# EAGLE design BDL Eagle (EAGLE 8.1.0)
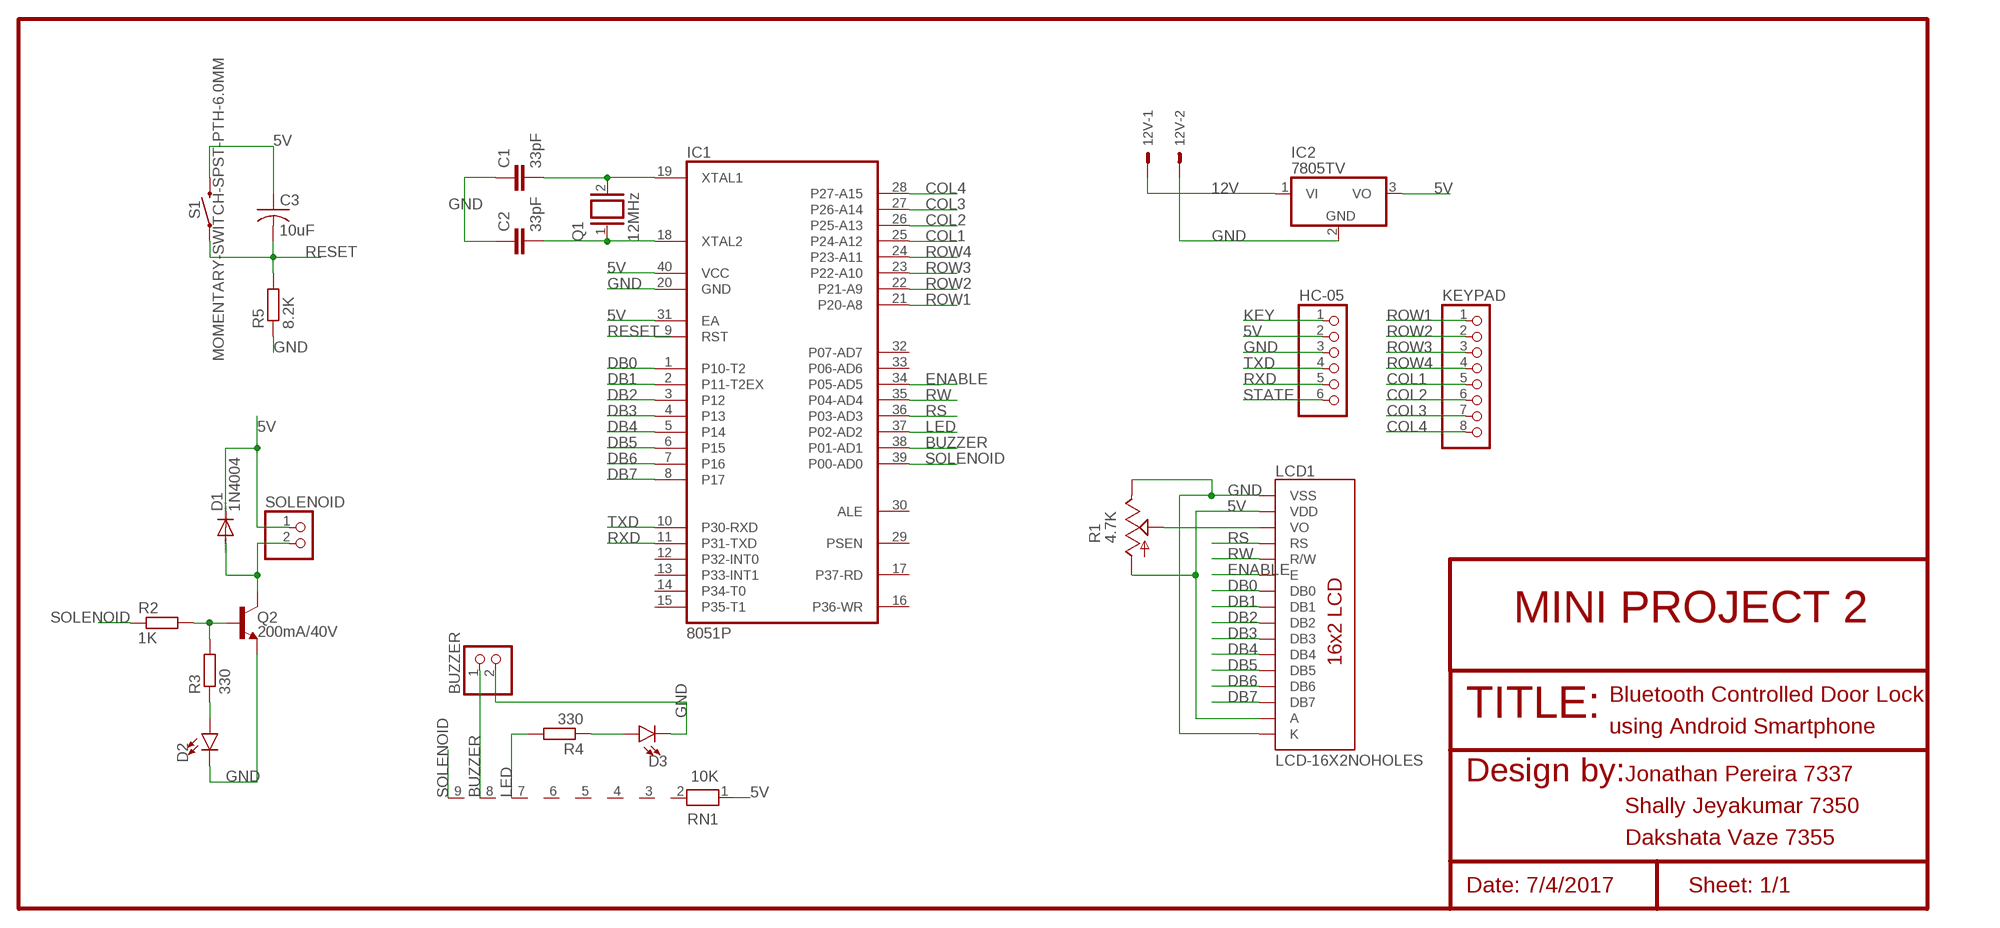
[diagram p0: schematic, sheet 1]

## Parts
12V  KK-156-2  [KK-156-2]
BUZZER  PINHD-1X2  [1X02]
C1  33pF  C2.5/2  [C2.5-2]
C2  33pF  C2.5/2  [C2.5-2]
C3  10uF  C-US025-050X050  [C025-050X050]
D1  1N4004  [DO41-10]
D2  LED5MM  [LED_5MM]
D3  LED5MM  [LED_5MM]
HC-05  PINHD-1X6  [1X06]
IC1  8051P  [DIL40]
IC2  7805TV  [TO220V]
KEYPAD  PINHD-1X8  [1X08]
LCD1  LCD-16X2NOHOLES  [LCD-16X2_NOHOLESNOSILK]
Q1  12MHz  XTAL/S  [QS]
Q2  200mA/40V  TRANS_NPN-2N3904-EZ  [TO-92-EZ]
R1  4.7K  TRIM_US-CA6V  [CA6V]
R2  1K  R-EU_0204/7  [0204/7]
R3  330  R-EU_0204/7  [0204/7]
R4  330  R-EU_0204/7  [0204/7]
R5  8.2K  R-EU_0204/7  [0204/7]
RN1  10K  RN08  [RN-9]
S1  MOMENTARY-SWITCH-SPST-PTH-6.0MM  [TACTILE_SWITCH_PTH_6.0MM]
SOLENOID  PINHD-1X2  [1X02]

## Nets
5V: C3.1 D1.C HC-05.2 IC1.31(EA) IC1.40(VCC) IC2.3(VO) LCD1.2(VDD) LCD1.15(A) R1.A RN1.1 S1.3 SOLENOID.1
12V: 12V.1 IC2.1(VI)
BUZZER: BUZZER.1 IC1.38(P01-AD1) RN1.8
COL1: IC1.25(P24-A12) KEYPAD.5
COL2: IC1.26(P25-A13) KEYPAD.6
COL3: IC1.27(P26-A14) KEYPAD.7
COL4: IC1.28(P27-A15) KEYPAD.8
DB0: IC1.1(P10-T2) LCD1.7(DB0)
DB1: IC1.2(P11-T2EX) LCD1.8(DB1)
DB2: IC1.3(P12) LCD1.9(DB2)
DB3: IC1.4(P13) LCD1.10(DB3)
DB4: IC1.5(P14) LCD1.11(DB4)
DB5: IC1.6(P15) LCD1.12(DB5)
DB6: IC1.7(P16) LCD1.13(DB6)
DB7: IC1.8(P17) LCD1.14(DB7)
ENABLE: IC1.34(P05-AD5) LCD1.6(E)
GND: 12V.2 BUZZER.2 C1.1 C2.1 D2.K(C) D3.K(C) HC-05.3 IC1.20(GND) IC2.2(GND) LCD1.1(VSS) LCD1.16(K) Q2.1(E) R1.E R5.1
KEY: HC-05.1
LED: IC1.37(P02-AD2) R4.2 RN1.7
N$1: C1.2 IC1.19(XTAL1) Q1.2
N$2: C2.2 IC1.18(XTAL2) Q1.1
N$3: D2.A R3.1
N$4: Q2.2(B) R2.2 R3.2
N$6: D3.A R4.1
N$7: D1.A Q2.3(C) SOLENOID.2
RESET: C3.2 R5.2 S1.1
ROW1: IC1.21(P20-A8) KEYPAD.1
ROW2: IC1.22(P21-A9) KEYPAD.2
ROW3: IC1.23(P22-A10) KEYPAD.3
ROW4: IC1.24(P23-A11) KEYPAD.4
RS: IC1.36(P03-AD3) LCD1.4(RS)
RW: IC1.35(P04-AD4) LCD1.5(R/W)
RXD: HC-05.5 IC1.11(P31-TXD)
SOLENOID: IC1.39(P00-AD0) R2.1 RN1.9
STATE: HC-05.6
TXD: HC-05.4 IC1.10(P30-RXD)
VO: LCD1.3(VO) R1.S
Unconnected: IC1.9(RST) IC1.12(P32-INT0) IC1.13(P33-INT1) IC1.14(P34-T0) IC1.15(P35-T1) IC1.16(P36-WR) IC1.17(P37-RD) IC1.29(PSEN) IC1.30(ALE) IC1.32(P07-AD7) IC1.33(P06-AD6) RN1.2 RN1.3 RN1.4 RN1.5 RN1.6

## Notes on the sheet
- MINI PROJECT 2
- Bluetooth Controlled Door Lock
- TITLE:
- using Android Smartphone
- Design by: | Jonathan Pereira 7337
- Shally Jeyakumar 7350
- Dakshata Vaze 7355
- Date: 7/4/2017 | Sheet: 1/1

## Library data of the parts
12V = con-molex:KK-156-2: KK 156 HEADER Source: http://www.molex.com/pdm_docs/sd/026604100_sd.pdf; OC_FARNELL: unknown; OC_NEWARK: unknown
BUZZER SOLENOID = pinhead:PINHD-1X2: PIN HEADER
C1 C2 = capacitor-wima:C: CAPACITOR naming: grid - package width
C3 = rcl:C-US: CAPACITOR, American symbol
D1 = diode:1N4004: DIODE general purpose rectifier, 1 A
D2 D3 = SparkFun-LED:LED: LED (Generic) Standard schematic elements and footprints for 5mm, 3mm, 1206, and 0603 sized LEDs. Generic LEDs with no color specified.
HC-05 = pinhead:PINHD-1X6: PIN HEADER
IC1 = micro-intel:8051: (CHMOS) SINGLE-CHIP 8-BIT MICROCONTROLLER 80C31BH / 80C51 BH / 87C51 MCS 51 Source: http://apps.intel.com .. 27041907.pdf; OC_FARNELL: unknown; OC_NEWARK: unknown
IC2 = linear:78*: Positive VOLTAGE REGULATOR Source: http://cache.national.com/ds/LM/LM78L05.pdf http://www.fairchildsemi.com/ds/LM/LM7805.pdf
KEYPAD = pinhead:PINHD-1X8: PIN HEADER
LCD1 = SparkFun-Displays:LCD-16X2: Standard text-only 16x2 parallel input LCD Basic 16 character by 2 line display. Typically utilizes the extremely common HD44780 parallel interface chipset SparkFun Products: Basic 16x2 Green <https://www.sparkfun.com/products/255> Basic 8x2 Green <https://www.sparkfun.com/products/11122>; SF_ID: LCD-00255
Q1 = special:XTAL/S: CRYSTAL
Q2 = SparkFun-DiscreteSemi:TRANS_NPN: NPN transistor Current controlled devices typically used to amplify current or used as a switch. BC547 - COM-08928 <http://www.sparkfun.com/products/8928> (TO-92 45V 100mA) (1.Collector 2.Base 3.Emitter) 2N3904 - COM-00521 <http://www.sparkfun.com/products/521> (TO-92 40V 200mA) (1.Emitter 2.Base 3.Collector) P2N2222A - COM-12852 <http://www.sparkfun.com/products/12852> (TO-92 40V 600mA) (1.Collector 2.Base 3.Emitter); PROD_ID: TRANS-08447
R1 = pot:TRIM_US-: POTENTIOMETER
R2 = rcl:R-EU_: RESISTOR, European symbol
R3-R5 = resistor:R-EU_: RESISTOR, European symbol
RN1 = resistor-net:RN08: RESISTOR NETWORK; OC_FARNELL: unknown; OC_NEWARK: unknown
S1 = SparkFun-Switches:MOMENTARY-SWITCH-SPST: Momentary Switch (Pushbutton) - SPST Normally-open (NO) SPST momentary switches (buttons, pushbuttons). Variants PTH-12MM - 12mm square, through-hole Momentary Pushbutton Switch - 12mm Square <https://www.sparkfun.com/products/9190> (COM-09190) PTH-6.0MM, PTH-6.0MM-KIT - 6.0mm square, through-hole Mini Pushbutton Switch <https://www.sparkfun.com/products/97> (COM-00097) KIT package intended for soldering kit's - only one side of pads' copper is exposed. PTH-RIGHT-ANGLE-KIT - Right-angle, through-hole Right Angle Tactile Button <https://www.sparkfun.com/products/10791> - Used on SparkFun BigTime Watch Kit <https://www.sparkfun.com/products/11734> SMD-12MM - 12mm square, surface-mount Tactile Button - SMD (12mm) <https://www.sparkfun.com/products/12993> (COM-12993) Used on SparkFun PicoBoard <https://www.sparkfun.com/products/11888> SMD-4.5MM - 4.5mm Square Trackball Switch Used on SparkFun Blackberry Trackballer Breakout <https://www.sparkfun.com/products/13169> SMD-4.6MMX2.8MM - 4.60mm x 2.80mm, surface mount Used on SparkFun SAMD21 Mini Breakout <https://www.sparkfun.com/products/13664> SMD-5.2MM, SMD-5.2-REDUNDANT - 5.2mm square, surface-mount Mini Pushbutton Switch - SMD <https://www.sparkfun.com/products/8720> (COM-08720) Used on Arduino Pro Mini <https://www.sparkfun.com/products/11114> REDUNDANT package connects both switch circuits together SMD-6.0X3.5MM - 6.0 x 3.5mm, surface mount Momentary Reset Switch SMD <https://www.sparkfun.com/products/8229> (COM-08229) SMD-6.2MM-TALL - 6.2mm square, surface mount Tactile Button - SMD (6mm) <https://www.sparkfun.com/products/12992> Used on SparkFun Digital Sandbox <https://www.sparkfun.com/products/12651> SMD-RIGHT-ANGLE - Right-angle, surface mount Used on SparkFun Block for Intel® Edison - Arduino <https://www.sparkfun.com/products/13036>; PROD_ID: SWCH-08441; SF_SKU: COM-00097

## Board
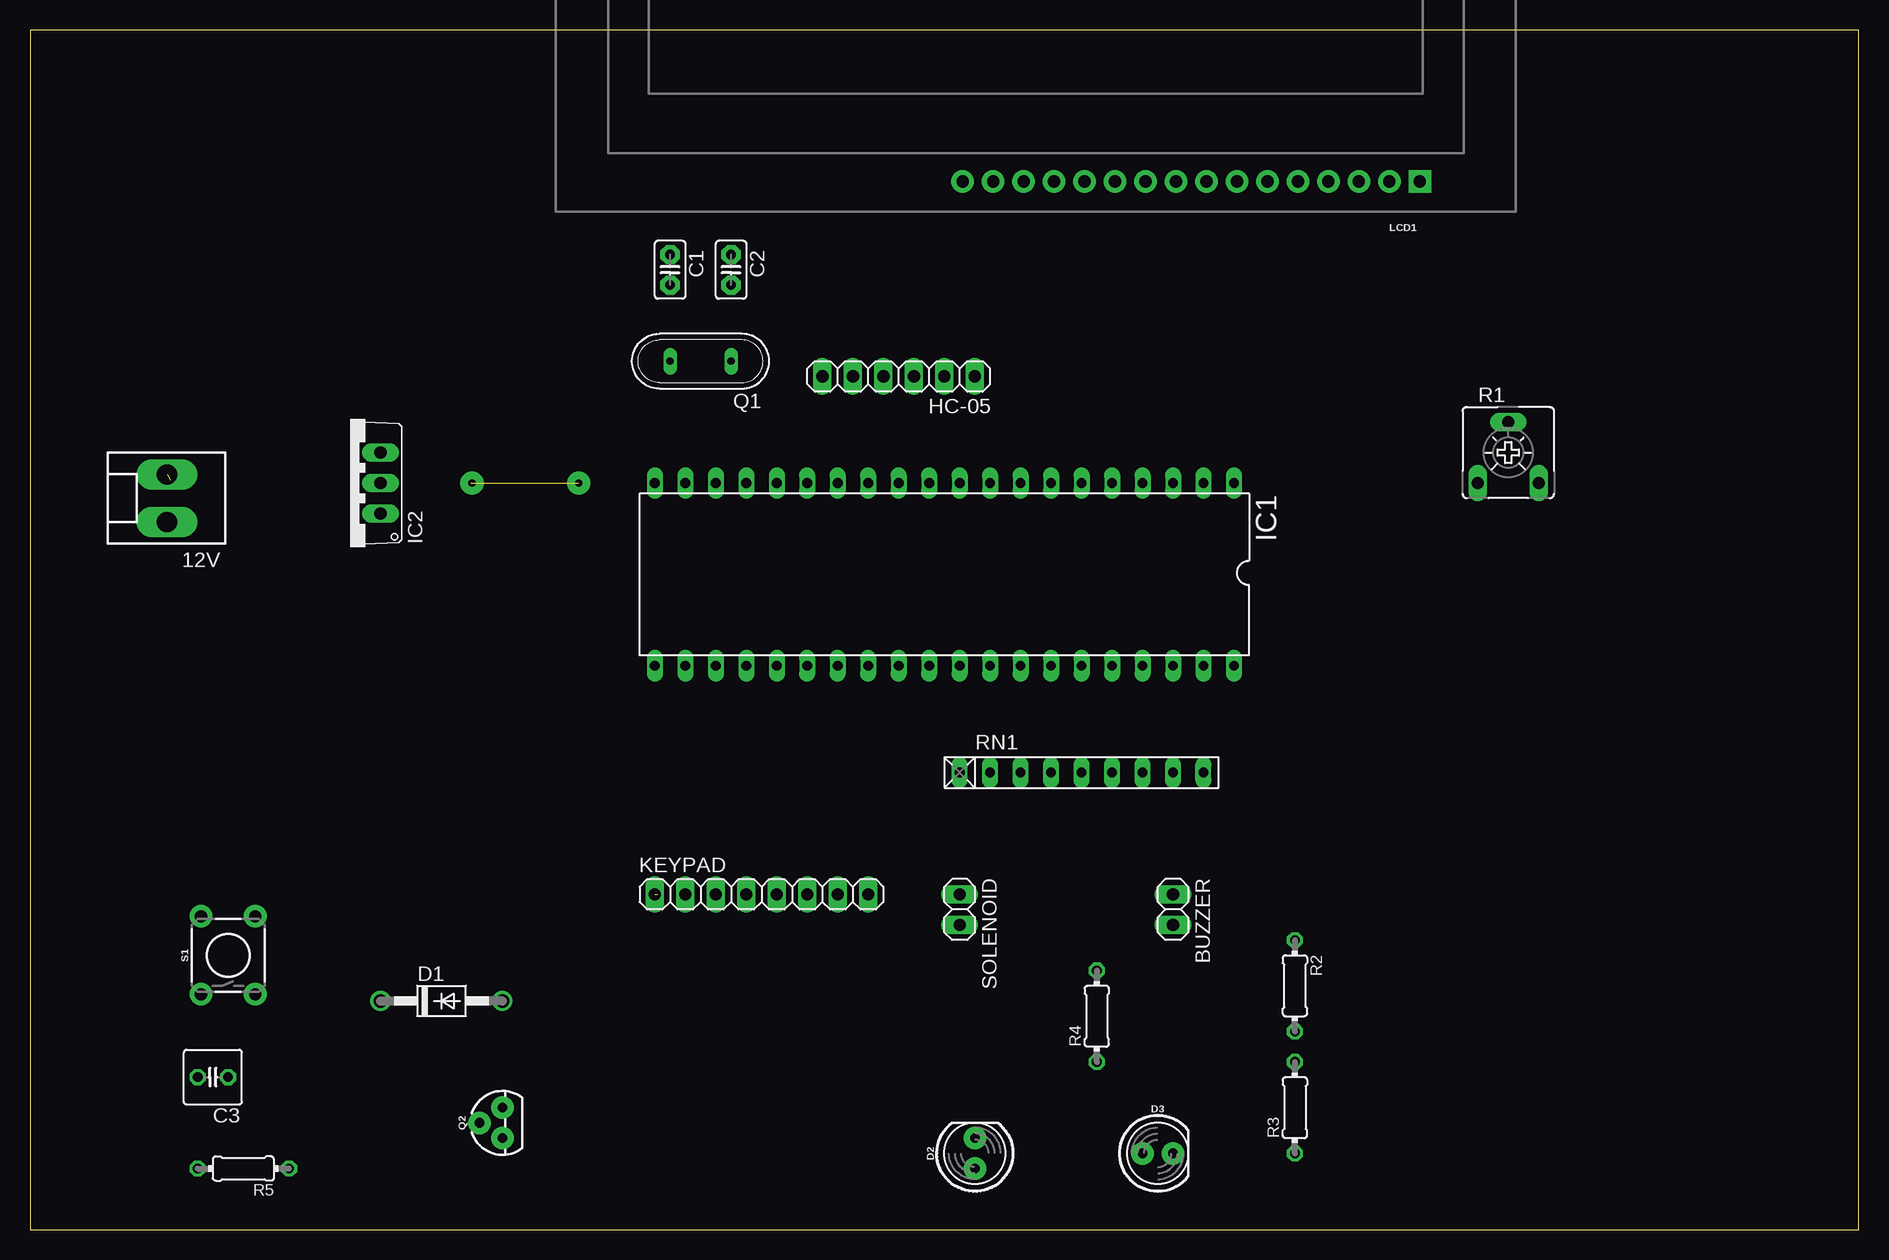
[diagram p1: board, top side]
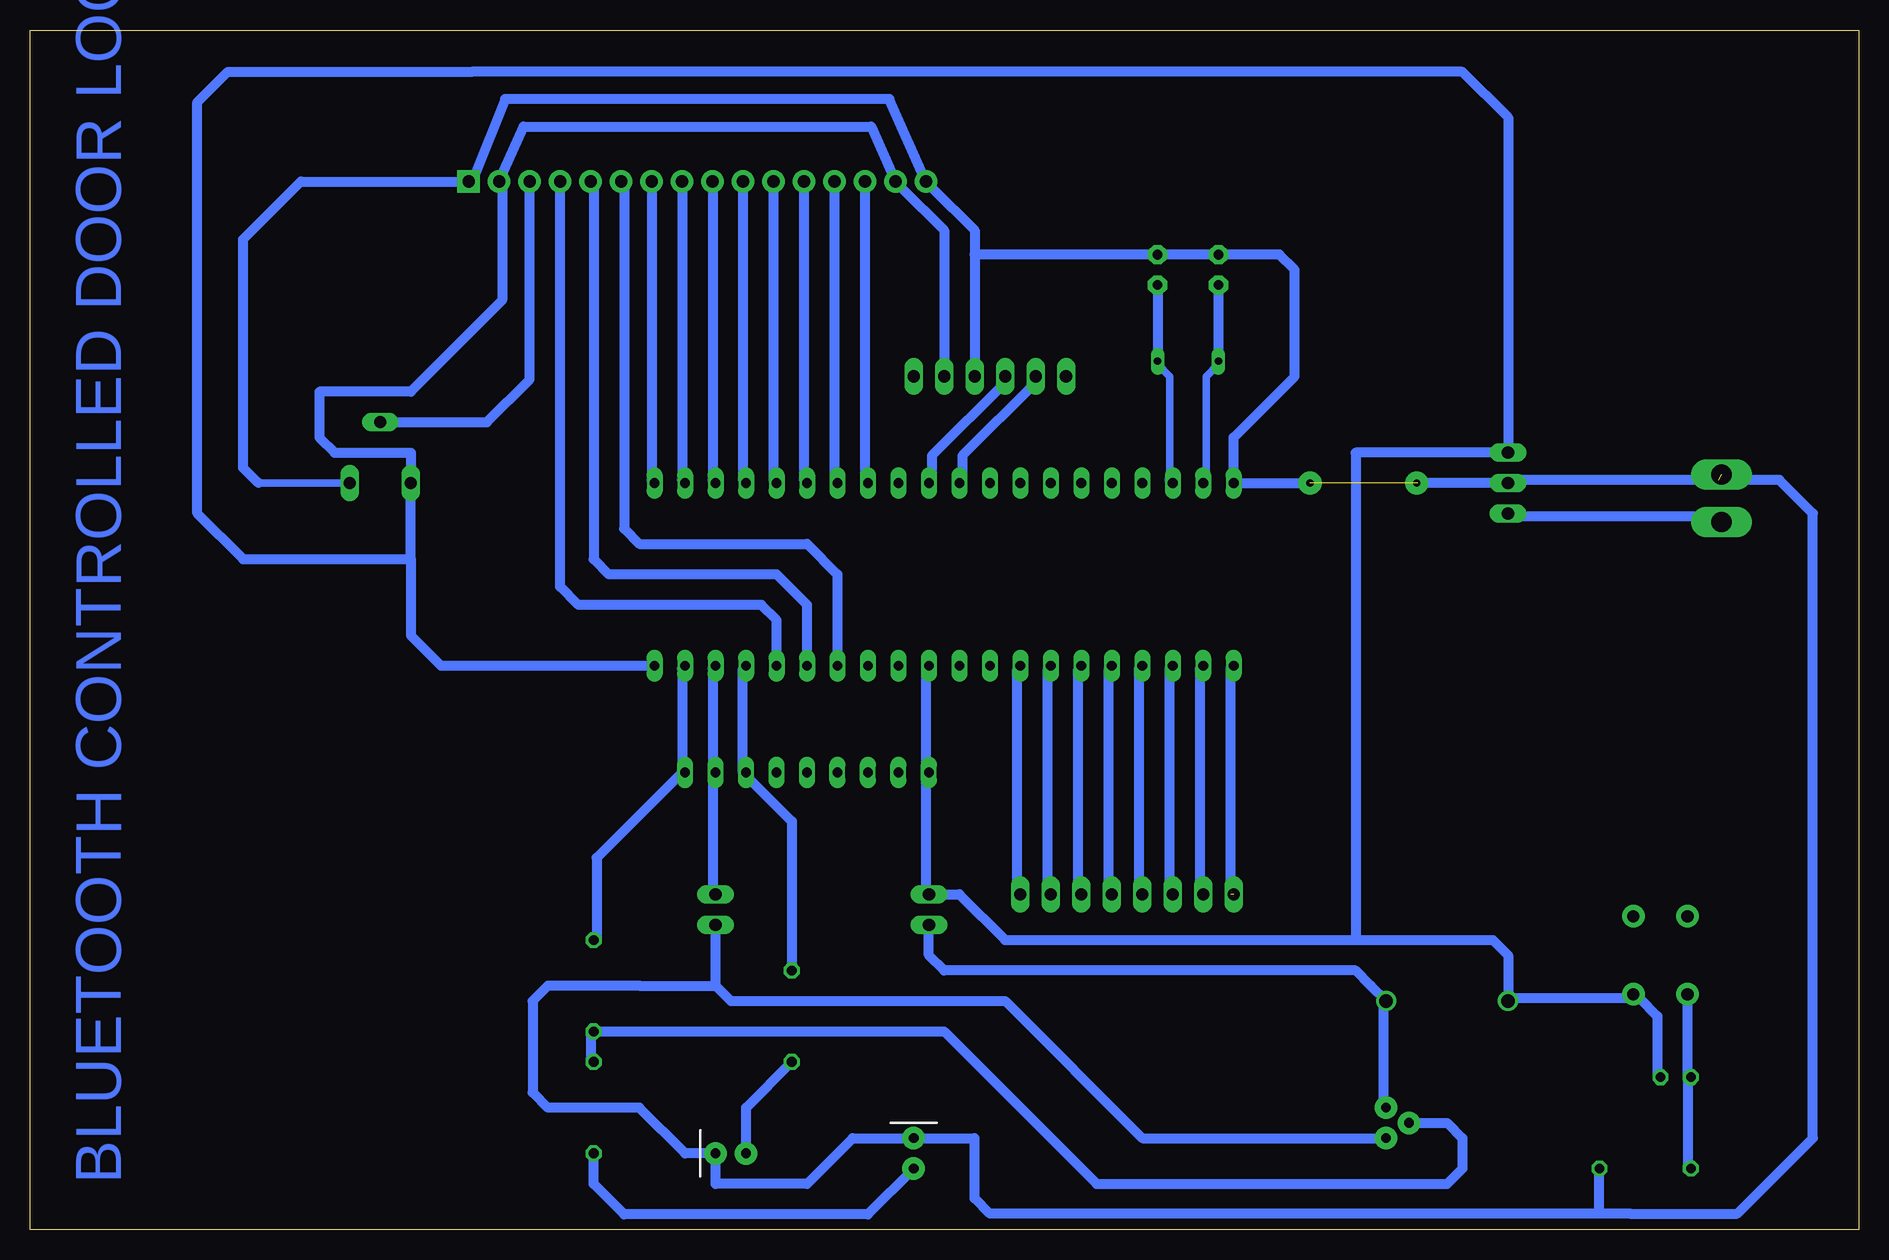
[diagram p2: board, bottom side, seen from below]

Size 152.38 x 100 mm. Coordinates in mm from the lower left corner, seen from the top.
Outline: 0,0 152.38,0 152.38,100 0,100 0,0
Copper layers (1*16): Top 0.035mm / dielectric 1.5mm / Bottom 0.035mm
Design rules "default *": minimum track width 20mil, minimum drill 24mil, track to track 20mil, track to pad 20mil, pad to pad 20mil, via to via 20mil, smd to smd 20mil, copper to edge 40mil, drill to drill 8mil, minimum pad ring 10mil, minimum via ring 8mil, stop-mask expansion 4mil, vias tented up to drill 0mil, thermal gap 10mil

### Footprints (pad centres in the part's own frame; a part is rotated, then mirrored left to right if it is on the bottom)
KK-156-2 = drill 1.7 pad 2.184 long: 1 -1.98,0; 2 1.98,0
1X02 = drill 1.016 long: 1 -1.27,0; 2 1.27,0
C2.5-2 = drill 0.813 pad 1.6 octagon: 1 -1.27,0; 2 1.27,0
C025-050X050 = drill 0.813 octagon: 1 -1.27,0; 2 1.27,0
DO41-10 = drill 1.118: A 5.08,0; C -5.08,0
LED_5MM = drill 0.813 pad 1.88: A -1.27,0; K 1.27,0
1X06 = drill 1.016 long: 1 -6.35,0; 2 -3.81,0; 3 -1.27,0; 4 1.27,0; 5 3.81,0; 6 6.35,0
DIL40 = drill 0.813 long: 1 -24.13,-7.62; 2 -21.59,-7.62; 3 -19.05,-7.62; 4 -16.51,-7.62; 5 -13.97,-7.62; 6 -11.43,-7.62; 7 -8.89,-7.62; 8 -6.35,-7.62; 9 -3.81,-7.62; 10 -1.27,-7.62; 11 1.27,-7.62; 12 3.81,-7.62; 13 6.35,-7.62; 14 8.89,-7.62; 15 11.43,-7.62; 16 13.97,-7.62; 17 16.51,-7.62; 18 19.05,-7.62; 19 21.59,-7.62; 20 24.13,-7.62; 21 24.13,7.62; 22 21.59,7.62; 23 19.05,7.62; 24 16.51,7.62; 25 13.97,7.62; 26 11.43,7.62; 27 8.89,7.62; 28 6.35,7.62; 29 3.81,7.62; 30 1.27,7.62; 31 -1.27,7.62; 32 -3.81,7.62; 33 -6.35,7.62; 34 -8.89,7.62; 35 -11.43,7.62; 36 -13.97,7.62; 37 -16.51,7.62; 38 -19.05,7.62; 39 -21.59,7.62; 40 -24.13,7.62
TO220V = drill 1.016 long: 1 -2.54,-2.54; 2 0,-2.54; 3 2.54,-2.54
1X08 = drill 1.016 long: 1 -8.89,0; 2 -6.35,0; 3 -3.81,0; 4 -1.27,0; 5 1.27,0; 6 3.81,0; 7 6.35,0; 8 8.89,0
LCD-16X2_NOHOLESNOSILK = drill 1.016 pad 1.88 square: 1 -32,15.5 | drill 1.016 pad 1.88: 2 -29.46,15.5; 3 -26.92,15.5; 4 -24.38,15.5; 5 -21.84,15.5; 6 -19.3,15.5; 7 -16.76,15.5; 8 -14.22,15.5; 9 -11.68,15.5; 10 -9.14,15.5; 11 -6.6,15.5; 12 -4.06,15.5; 13 -1.52,15.5; 14 1.02,15.5; 15 3.56,15.5; 16 6.1,15.5
QS = drill 0.61 long: 1 -2.54,0; 2 2.54,0
TO-92-EZ = drill 0.813 pad 1.88: 1 -1.27,0; 2 0,1.905; 3 1.27,0
CA6V = drill 1.016 long: A -2.54,-2.54; E 2.54,-2.54; S 0,2.54
0204/7 = drill 0.813 octagon: 1 -3.81,0; 2 3.81,0
RN-9 = drill 0.813 long: 1 -10.16,0; 2 -7.62,0; 3 -5.08,0; 4 -2.54,0; 5 0,0; 6 2.54,0; 7 5.08,0; 8 7.62,0; 9 10.16,0
TACTILE_SWITCH_PTH_6.0MM = drill 1.016 pad 1.88: 1 -3.251,2.261; 2 3.251,2.261; 3 -3.251,-2.261; 4 3.251,-2.261

### Placement (x,y rotation side)
12V  11.43,60.96 90 top
BUZZER  95.25,26.67 270 top
C1  53.34,80.01 270 top
C2  58.42,80.01 270 top
C3  15.24,12.7 180 top
D1  34.29,19.05 0 top
D2  78.74,6.35 90 top
D3  93.98,6.35 0 top
HC-05  72.39,71.12 180 top
IC1  76.2,54.61 180 top
IC2  26.67,62.23 90 top
KEYPAD  60.96,27.94 0 top
LCD1  83.82,102.87 180 top
Q1  55.88,72.39 180 top
Q2  39.37,8.89 90 top
R1  123.19,64.77 0 top
R2  105.41,20.32 270 top
R3  105.41,10.16 90 top
R4  88.9,17.78 90 top
R5  17.78,5.08 180 top
RN1  87.63,38.1 0 top
S1  16.51,22.86 90 top
SOLENOID  77.47,26.67 270 top

### Tracks (layer width: path | path; a pad name or v marks a point on that pad's centre or on a via)
5V
  Bottom 0.508: 79.76,86.87 LCD1.15 | 100.58,47.24 IC1.40 | 113.28,86.87 LCD1.2 | R1.A 120.9,61.98 | 77.72,46.74 IC1.31 | 77.72,27.94 SOLENOID.1 | 77.72,38.1 RN1.1 | 16.76,12.7 C3.1 | 18.29,19.3 S1.3 18.8,19.3 | D1.C 28.96,19.3 | 115.57,96.52 116.08,96.52
  Bottom 0.61: LCD1.2 113.03,87.12
  Bottom 0.813: HC-05.2 76.2,83.31 79.76,86.87 | LCD1.15 82.3,91.95 111.25,91.95 LCD1.2 | 77.72,46.74 77.72,38.1 77.72,27.94 | 16.76,12.7 16.76,17.78 18.29,19.3 | 28.96,19.3 18.8,19.3 | 120.65,55.88 134.62,55.88 138.43,59.69 138.43,93.98 135.89,96.52 115.57,96.52 33.02,96.52 29.21,92.71 IC2.3 41.91,64.77 41.91,24.13 | IC1.40 118.11,46.99 120.65,49.53 120.65,55.88 | 120.65,55.88 R1.A 120.65,64.77 127,64.77 128.27,66.04 128.27,69.85 120.65,69.85 113.03,77.47 113.03,87.12 | SOLENOID.1 74.93,27.94 71.12,24.13 41.91,24.13 | 41.91,24.13 30.48,24.13 29.21,22.86 D1.C
12V
  Bottom 0.508: 28.96,59.44 IC2.1 | 11.68,59.44 12V.1
  Bottom 0.813: 11.68,59.44 28.96,59.44
BUZZER
  Bottom 0.508: 95.5,46.74 IC1.38 | 95.5,27.94 BUZZER.1 | 95.5,38.1 RN1.8
  Bottom 0.813: 95.5,46.74 95.5,38.1 95.5,27.94
COL1
  Bottom 0.508: 62.48,46.74 IC1.25 | 62.48,27.94 KEYPAD.5
  Bottom 0.813: 62.48,27.94 62.48,46.74
COL2
  Bottom 0.508: 65.02,46.74 IC1.26 | 65.02,27.94 KEYPAD.6
  Bottom 0.813: 65.02,27.94 65.02,46.74
COL3
  Bottom 0.508: 67.56,46.74 IC1.27 | 67.56,27.94 KEYPAD.7
  Bottom 0.813: 67.56,27.94 67.56,46.74
COL4
  Bottom 0.508: 70.1,46.74 IC1.28 | 70.1,27.94 KEYPAD.8
  Bottom 0.813: 70.1,27.94 70.1,46.74
DB0
  Bottom 0.508: 100.58,62.48 IC1.1 | 100.58,86.87 LCD1.7
  Bottom 0.813: 100.58,86.87 100.58,62.48
DB1
  Bottom 0.508: 98.04,62.48 IC1.2 | 98.04,86.87 LCD1.8
  Bottom 0.813: 98.04,86.87 98.04,62.48
DB2
  Bottom 0.508: 95.5,62.48 IC1.3 | 95.5,86.87 LCD1.9
  Bottom 0.813: 95.5,86.87 95.5,62.48
DB3
  Bottom 0.813: IC1.4 92.96,62.48 92.96,86.87 LCD1.10
DB4
  Bottom 0.813: IC1.5 90.42,62.48 90.42,86.87 LCD1.11
DB5
  Bottom 0.813: IC1.6 87.88,62.48 87.88,86.87 LCD1.12
DB6
  Bottom 0.813: IC1.7 85.34,62.48 85.34,86.87 LCD1.13
DB7
  Bottom 0.813: IC1.8 82.8,62.48 82.8,86.87 LCD1.14
ENABLE
  Bottom 0.508: 85.34,47.75 85.34,47.24 IC1.34 | 102.62,86.87 LCD1.6
  Bottom 0.61: LCD1.6 102.87,87.12
  Bottom 0.813: 102.87,87.12 102.87,58.42 101.6,57.15 87.63,57.15 85.09,54.61 IC1.34
GND  (via drill 0.6 pad 1.93)  (2 unrouted)
  Bottom 0.508: D3.K 95.5,6.6 | 95,25.4 BUZZER.2 | 12.7,62.48 11.68,62.48 | 28.96,62.48 IC2.2 | 125.98,62.48 R1.E | 115.82,86.87 LCD1.1 115.32,87.38 115.32,87.88 | 77.22,86.87 LCD1.16 | 51.82,62.48 IC1.20
  Bottom 0.61: 21.34,5.08 R5.1 | R1.E 133.35,62.23 | 100.33,20.32 101.6,20.32 | 19.05,1.32 | 21.59,1.32
  Bottom 0.813: 28.96,62.48 12.7,62.48 6.6,62.48 3.81,59.69 3.81,7.62 10.11,1.32 19.05,1.32 21.59,1.32 | 73.66,81.28 73.66,83.31 77.22,86.87 | 73.66,81.28 HC-05.3 | 73.66,81.28 C2.1 C1.1 48.26,81.28 46.99,80.01 46.99,71.12 52.07,66.04 IC1.20 v45.72,62.23 | 115.32,87.88 112.78,94.23 80.77,94.23 LCD1.16 | IC2.2 36.72,62.23 | 133.35,62.23 134.62,63.5 134.62,82.55 129.8,87.37 LCD1.1 | 21.59,1.32 R5.1 | 21.59,1.32 72.39,1.32 73.66,2.59 73.66,7.62 D2.K 83.82,7.62 87.63,3.81 95.25,3.81 D3.K 97.79,6.35 101.6,10.16 109.22,10.16 110.49,11.43 110.49,19.05 109.22,20.32 101.6,20.32 95.25,20.32 | 95.25,20.32 BUZZER.2 | 95.25,20.32 93.98,19.05 71.12,19.05 59.69,7.62 Q2.1
LED
  Bottom 0.508: 92.96,46.74 IC1.37 | 92.96,38.1 RN1.7
  Bottom 0.813: R4.2 88.9,34.04 92.96,38.1 92.96,46.74
N$1
  Bottom 0.508: 53.34,72.14 Q1.2
  Bottom 0.61: 54.36,62.48 54.36,71.12 53.34,72.14
  Bottom 0.813: C1.2 Q1.2 | 54.36,62.48 IC1.19
N$2
  Bottom 0.508: 58.42,72.14 Q1.1
  Bottom 0.61: 57.4,62.48 57.4,71.12 58.42,72.14
  Bottom 0.813: C2.2 Q1.1 | 57.4,62.48 IC1.18
N$3
  Bottom 0.508: R3.1 105.16,6.1
  Bottom 0.813: R3.1 105.41,3.81 102.87,1.27 82.55,1.27 D2.A
N$4
  Bottom 0.508: 105.66,16.26 R2.2 105.16,16.26 | 37.59,8.64 Q2.2
  Bottom 0.813: 105.66,16.26 105.66,14.22 R3.2 | Q2.2 34.29,8.89 33.02,7.62 33.02,5.08 34.29,3.81 63.5,3.81 76.2,16.51 R2.2
N$5  (via drill 0.6 pad 1.93)
  other vias: 36.83,62.23
N$6
  Bottom 0.813: R4.1 92.71,10.16 D3.A
N$7
  Bottom 0.508: 40.64,20.32 41.15,20.83 | 39.62,10.16 Q2.3 | 39.62,18.8 D1.A
  Bottom 0.813: D1.A 40.64,20.32 41.91,21.59 76.2,21.59 77.47,22.86 SOLENOID.2 | 39.62,18.8 39.62,10.16
RESET
  Bottom 0.508: 14.22,19.3 S1.1 | 14.22,12.7 C3.2
  Bottom 0.61: 14.22,5.08 R5.2
  Bottom 0.813: 14.22,5.08 14.22,12.7 14.22,19.3
ROW1  (1 unrouted)
  Bottom 0.508: 52.32,46.74 IC1.21
  Bottom 0.813: 52.32,27.94 52.32,46.74
ROW2
  Bottom 0.508: 54.86,46.74 IC1.22 | 54.86,27.94 KEYPAD.2
  Bottom 0.813: 54.86,27.94 54.86,46.74
ROW3
  Bottom 0.508: 57.4,46.74 IC1.23 | 57.4,27.94 KEYPAD.3
  Bottom 0.813: 57.4,27.94 57.4,46.74
ROW4
  Bottom 0.508: 59.94,46.74 IC1.24 | 59.94,27.94 KEYPAD.4
  Bottom 0.813: 59.94,27.94 59.94,46.74
RS
  Bottom 0.508: 90.42,47.75 90.42,47.24 IC1.36
  Bottom 0.61: LCD1.4 107.95,87.12
  Bottom 0.813: IC1.36 90.17,50.8 91.44,52.07 106.68,52.07 108.2,53.59 LCD1.4
RW
  Bottom 0.508: 87.88,47.75 87.88,47.24 IC1.35
  Bottom 0.61: LCD1.5 105.41,87.12
  Bottom 0.813: IC1.35 87.63,52.07 90.17,54.61 104.14,54.61 105.41,55.88 105.41,87.12
RXD
  Bottom 0.813: HC-05.5 68.58,70.61 74.68,64.52 74.68,62.48 IC1.11
SOLENOID
  Bottom 0.508: 98.04,46.74 IC1.39 | 105.16,24.38 R2.1 | 98.04,38.1 RN1.9
  Bottom 0.813: 98.04,46.74 98.04,38.1 105.16,30.99 105.16,24.38
TXD
  Bottom 0.813: HC-05.4 71.12,70.61 77.22,64.52 77.22,62.48 IC1.10
VO
  Bottom 0.508: 122.94,67.56 R1.S | 110.74,86.87 LCD1.3
  Bottom 0.813: R1.S 114.3,67.31 110.74,70.87 110.74,86.87

### Text on the board
Bottom: BLUETOOTH CONTROLLED DOOR LOCK